# Altium schematic sheet Microcontroller.SchDoc: =SheetTitle
size B; SheetTitle: Microcontroller; DrawnBy: Samyar Sadat Akhavi; SheetNumber: 6; SheetTotal: 19
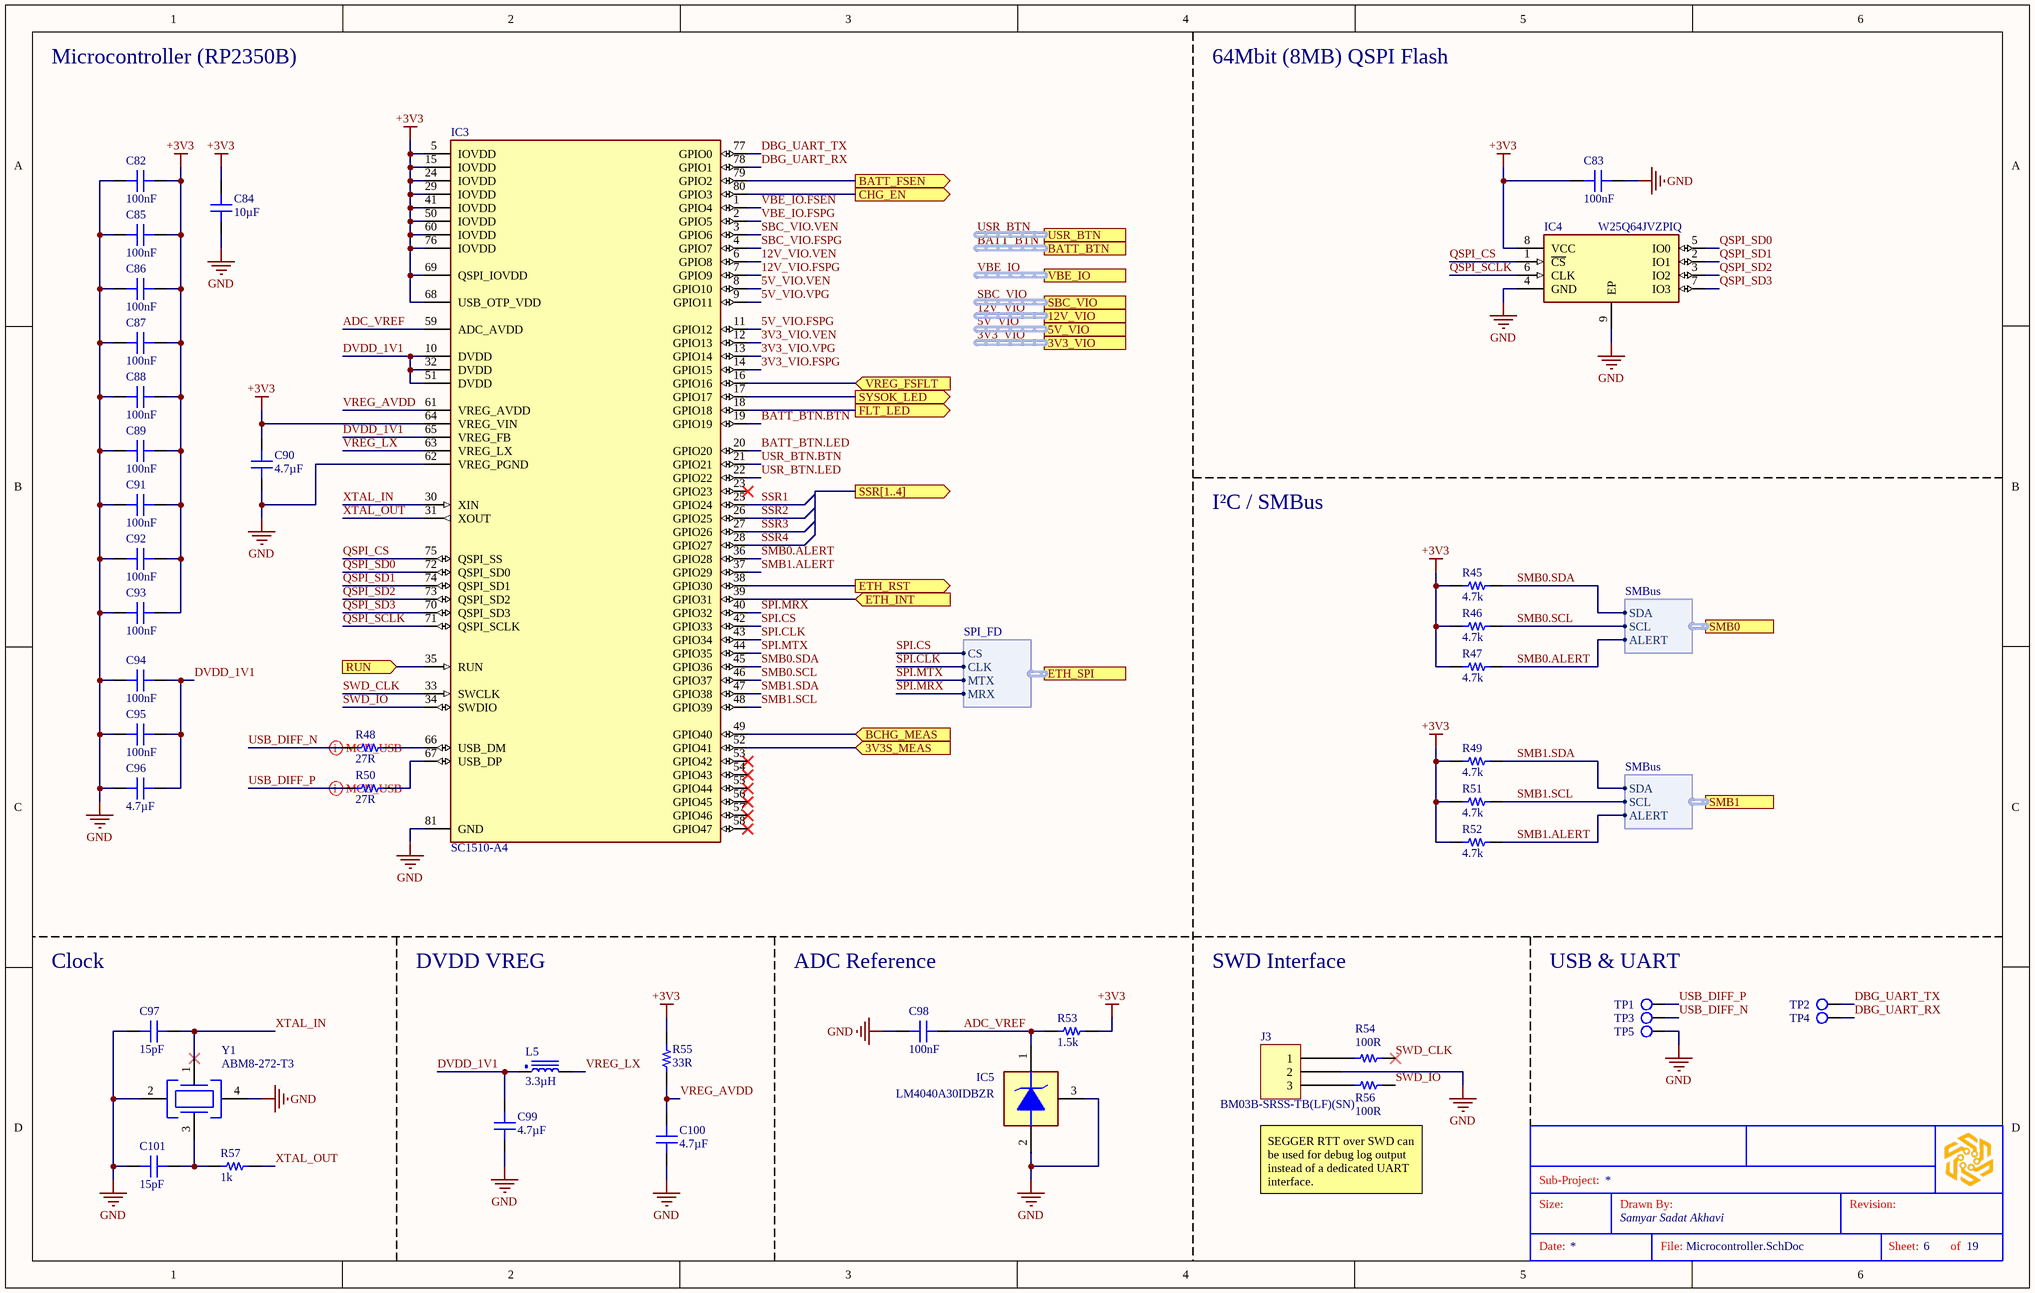
[diagram p0: Microcontroller.SchDoc]

## Parts
?  (no value)  (graphical)
C82  100nF  [CAP 0402_1005]
C83  100nF  [CAP 0603_1608]
C84  10µF  [CAP 1206_3216]
C85  100nF  [CAP 0402_1005]
C86  100nF  [CAP 0402_1005]
C87  100nF  [CAP 0402_1005]
C88  100nF  [CAP 0402_1005]
C89  100nF  [CAP 0402_1005]
C90  4.7µF  [CAP 0402_1005]
C91  100nF  [CAP 0402_1005]
C92  100nF  [CAP 0402_1005]
C93  100nF  [CAP 0402_1005]
C94  100nF  [CAP 0402_1005]
C95  100nF  [CAP 0402_1005]
C96  4.7µF  [CAP 0402_1005]
C97  15pF  [CAP 0402_1005]
C98  100nF  [CAP 0603_1608]
C99  4.7µF  [CAP 0402_1005]
C100  4.7µF  [CAP 0402_1005]
C101  15pF  [CAP 0402_1005]
IC3  SC1510-A4  [QFN40P1000X1000X90-81N-D]
IC4  W25Q64JVZPIQ  [SON127P600X500X80-9N-D]
IC5  LM4040A30IDBZR  [SOT95P237X112-3N]
J3  BM03B-SRSS-TB(LF)(SN)  [JST BM03B-SRSS-TB]
L5  3.3µH  [AOTAB201610S3R3101T]
R45  4.7k  [RES 0603_1608]
R46  4.7k  [RES 0603_1608]
R47  4.7k  [RES 0603_1608]
R48  27R  [RES 0603_1608]
R49  4.7k  [RES 0603_1608]
R50  27R  [RES 0603_1608]
R51  4.7k  [RES 0603_1608]
R52  4.7k  [RES 0603_1608]
R53  1.5k  [RES 0603_1608]
R54  100R  [RES 0603_1608]
R55  33R  [RES 0402_1005]
R56  100R  [RES 0603_1608]
R57  1k  [RES 0402_1005]
TP1  Test Point  [Test_Point_2mm]  (value not drawn)  (no BOM)
TP2  Test Point  [Test_Point_2mm]  (value not drawn)  (no BOM)
TP3  Test Point  [Test_Point_2mm]  (value not drawn)  (no BOM)
TP4  Test Point  [Test_Point_2mm]  (value not drawn)  (no BOM)
TP5  Test Point  [Test_Point_2mm]  (value not drawn)  (no BOM)
Y1  ABM8-272-T3  [ABM8272T3]

## Ports
3V3_VIO (harness V3I_VIO, see Power_Board[3B], Voltage_Regulators[5D]), 3V3S_MEAS (in, see Power_Board[2A], Power_Reset[4C]), 5V_VIO (harness V3I_VIO, see Power_Board[3B], Voltage_Regulators[5C]), 12V_VIO (harness VHP_VIO, see Power_Board[3B], Voltage_Regulators[5B]), BATT_BTN (harness USR_BTN, see Power_Board[2B], User_Control_IO[4A]), BATT_FSEN (out, see Power_Board[2B]), BCHG_MEAS (in, see Power_Board[2B], Charger_Input[2B]), CHG_EN (out, see Power_Board[2B], Charger_Input[1B]), ETH_INT (in, see Power_Board[3B]), ETH_RST (out, see Power_Board[3B]), ETH_SPI (harness SPI_FD, see Power_Board[3B]), FLT_LED (out, see Power_Board[3C]), RUN (in, see Power_Board[2A]), SBC_VIO (harness VHP_VIO, see Power_Board[3B], Voltage_Regulators[5A]), SMB0 (harness SMBus, see Power_Board[2C]), SMB1 (harness SMBus, see Power_Board[2C]), SSR[1..4] (out, see Power_Board[3B], External_SSR[2A]), SYSOK_LED (out, see Power_Board[3C]), USR_BTN (harness USR_BTN, see Power_Board[2B], User_Control_IO[4C]), VBE_IO (harness VBP_IO, see Power_Board[3A], VBAT_Output[1B]), VREG_FSFLT (in, see Power_Board[3B])

## Harnesses
SMBus: SDA, SCL, ALERT
SPI_FD: MRX, MTX, CLK, CS

## Nets
+3V3: C82.2 C83.1 C84.2 C85.2 C86.2 C87.2 C88.2 C89.2 C90.2 C91.2 C92.2 C93.2 IC3.5(IOVDD) IC3.15(IOVDD) IC3.24(IOVDD) IC3.29(IOVDD) IC3.41(IOVDD) IC3.50(IOVDD) IC3.60(IOVDD) IC3.64(VREG_VIN) IC3.68(USB_OTP_VDD) IC3.69(QSPI_IOVDD) IC3.76(IOVDD) IC4.8(VCC) R45.1 R46.1 R47.1 R49.1 R51.1 R52.1 R53.2 R55.2
GND: C82.1 C83.2 C84.1 C85.1 C86.1 C87.1 C88.1 C89.1 C90.1 C91.1 C92.1 C93.1 C94.1 C95.1 C96.1 C97.1 C98.1 C99.1 C100.1 C101.1 IC3.62(VREG_PGND) IC3.81(GND) IC4.4(GND) IC4.9(EP) IC5.2(A) IC5.3 J3.2 TP5.1 Y1.2(GND_1) Y1.4(GND_2)
3V3_VIO.FSPG: IC3.14(GPIO15)
3V3_VIO.VEN: IC3.12(GPIO13)
3V3_VIO.VPG: IC3.13(GPIO14)
3V3S_MEAS: IC3.52(GPIO41) ; port 3V3S_MEAS
5V_VIO.FSPG: IC3.11(GPIO12)
5V_VIO.VEN: IC3.8(GPIO10)
5V_VIO.VPG: IC3.9(GPIO11)
12V_VIO.FSPG: IC3.7(GPIO9)
12V_VIO.VEN: IC3.6(GPIO8)
ADC_VREF: C98.2 IC3.59(ADC_AVDD) IC5.1(K) R53.1
BATT_BTN.BTN: IC3.19(GPIO19)
BATT_BTN.LED: IC3.20(GPIO20)
BATT_FSEN: IC3.79(GPIO2) ; port BATT_FSEN
BCHG_MEAS: IC3.49(GPIO40) ; port BCHG_MEAS
CHG_EN: IC3.80(GPIO3) ; port CHG_EN
DBG_UART_RX: IC3.78(GPIO1) TP4.1
DBG_UART_TX: IC3.77(GPIO0) TP2.1
DVDD_1V1: C94.2 C95.2 C96.2 C99.2 IC3.10(DVDD) IC3.32(DVDD) IC3.51(DVDD) IC3.65(VREG_FB) L5.1
ETH_INT: IC3.39(GPIO31) ; port ETH_INT
ETH_RST: IC3.38(GPIO30) ; port ETH_RST
FLT_LED: IC3.18(GPIO18) ; port FLT_LED
QSPI_CS: IC3.75(QSPI_SS) IC4.1(~{CS})
QSPI_SCLK: IC3.71(QSPI_SCLK) IC4.6(CLK)
QSPI_SD0: IC3.72(QSPI_SD0) IC4.5(IO0)
QSPI_SD1: IC3.74(QSPI_SD1) IC4.2(IO1)
QSPI_SD2: IC3.73(QSPI_SD2) IC4.3(IO2)
QSPI_SD3: IC3.70(QSPI_SD3) IC4.7(IO3)
RUN: IC3.35(RUN) ; port RUN
SBC_VIO.FSPG: IC3.4(GPIO7)
SBC_VIO.VEN: IC3.3(GPIO6)
SMB0.ALERT: IC3.36(GPIO28) R47.2 ; port SMB0.ALERT
SMB0.SCL: IC3.46(GPIO37) R46.2 ; port SMB0.SCL
SMB0.SDA: IC3.45(GPIO36) R45.2 ; port SMB0.SDA
SMB1.ALERT: IC3.37(GPIO29) R52.2 ; port SMB1.ALERT
SMB1.SCL: IC3.48(GPIO39) R51.2 ; port SMB1.SCL
SMB1.SDA: IC3.47(GPIO38) R49.2 ; port SMB1.SDA
SPI.CLK: IC3.43(GPIO34) ; port ETH_SPI.CLK
SPI.CS: IC3.42(GPIO33) ; port ETH_SPI.CS
SPI.MRX: IC3.40(GPIO32) ; port ETH_SPI.MRX
SPI.MTX: IC3.44(GPIO35) ; port ETH_SPI.MTX
SSR1: IC3.25(GPIO24)
SSR2: IC3.26(GPIO25)
SSR3: IC3.27(GPIO26)
SSR4: IC3.28(GPIO27)
SWD_CLK: IC3.33(SWCLK) R54.1
SWD_IO: IC3.34(SWDIO) R56.1
SYSOK_LED: IC3.17(GPIO17) ; port SYSOK_LED
USB_DIFF_N: R48.1 TP3.1
USB_DIFF_P: R50.1 TP1.1
USR_BTN.BTN: IC3.21(GPIO21)
USR_BTN.LED: IC3.22(GPIO22)
VBE_IO.FSEN: IC3.1(GPIO4)
VBE_IO.FSPG: IC3.2(GPIO5)
VREG_AVDD: C100.2 IC3.61(VREG_AVDD) R55.1
VREG_FSFLT: IC3.16(GPIO16) ; port VREG_FSFLT
VREG_LX: IC3.63(VREG_LX) L5.2
XTAL_IN: C97.2 IC3.30(XIN) Y1.1(CRYSTAL_1)
XTAL_OUT: IC3.31(XOUT) R57.2
NetC101_2: C101.2 R57.1 Y1.3(CRYSTAL_2)
NetIC3_66: IC3.66(USB_DM) R48.2
NetIC3_67: IC3.67(USB_DP) R50.2
NetJ3_1: J3.1 R54.2
NetJ3_3: J3.3 R56.2

Not connected (* = marked no-connect by the designer): IC3 23(GPIO23)* 53(GPIO42)* 54(GPIO43)* 55(GPIO44)* 56(GPIO45)* 57(GPIO46)* 58(GPIO47)*

## Buses and harness runs
harness 3V3_VIO = port 3V3_VIO
harness 5V_VIO = port 5V_VIO
harness 12V_VIO = port 12V_VIO
harness BATT_BTN = port BATT_BTN
harness SBC_VIO = port SBC_VIO
harness USR_BTN = port USR_BTN
harness VBE_IO = port VBE_IO

## Layout directives
differential pair: USB_DIFF_N, USB_DIFF_P

## Notes on the sheet
- Microcontroller (RP2350B)
- 64Mbit (8MB) QSPI Flash
- I²C / SMBus
- Clock
- DVDD VREG
- ADC Reference
- SWD Interface
- USB & UART
- SEGGER RTT over SWD can be used for debug log output instead of a dedicated UART interface.
- Sub-Project:
- Size:
- Drawn By:
- Revision:
- Date:
- File:
- Sheet:
- of

## Library data of the parts
? = SGR-STDTBSB: STANDARD SCHEMATICS TITLE BLOCK
C82 C85-C89 C91-C95 = GEN-CC100NT106V3KX7R402: GENERIC 0402 MLC CAPACITOR; Tolerance: ±10%; Voltage: 6.3V; Dielectric: X7R; Part Number: GEN-CC100NT106V3KX7R402; Value: 100nF
C83 C98 = GEN-CC100NT10V50KX7R603: GENERIC 0603 MLC CAPACITOR; Tolerance: ±10%; Voltage: 50V; Dielectric: X7R; Part Number: GEN-CC100NT10V50KX7R603; Value: 100nF
C84 = GEN-CC10UT10V25KX7R1206: GENERIC 1206 MLC CAPACITOR; Tolerance: ±10%; Voltage: 25V; Dielectric: X7R; Part Number: GEN-CC10UT10V25KX7R1206; Value: 10µF
C90 C96 C99 C100 = GEN-CC4U7T106V3KX5R402: GENERIC 0402 MLC CAPACITOR; Tolerance: ±10%; Voltage: 6.3V; Dielectric: X5R; Part Number: GEN-CC4U7T106V3KX5R402; Value: 4.7µF
C97 C101 = GEN-CC15PT1V25KC0G402: GENERIC 0402 MLC CAPACITOR; Tolerance: ±1%; Voltage: 25V; Dielectric: C0G; Part Number: GEN-CC15PT1V25KC0G402; Value: 15pF
IC3 = SC1510-A4: RASPBERRY PI RP2350B A4 MICROCONTROLLER; Part Number: SC1510-A4; Manufacturer: Raspberry Pi; Supplier 1: DigiKey; Supplier Part Number 1: 2648-SC1510-A4CT-ND
IC4 = W25Q64JVZPIQ: IC FLASH 64MBIT SPI/QUAD 8WSON; Manufacturer: Winbond Electronics; Part Number: W25Q64JVZPIQ; Supplier 1: DigiKey; Supplier Part Number 1: 256-W25Q64JVZPIQ-TRAY-ND
IC5 = LM4040A30IDBZR: IC VREF SHUNT 0.1% SOT23-3; Manufacturer: Texas Instruments; Part Number: LM4040A30IDBZR; Supplier 1: DigiKey; Supplier Part Number 1: 296-20861-1-ND
J3 = BM03B-SRSS-TB(LF)(SN): CONN HEADER SMD 3POS 1MM; Manufacturer: JST Sales America Inc.; Current Rating (Amps): 0.7A; Material Flammability Rating: UL94 V-0; Number of Positions: 3; Number of Positions Loaded: All; Pitch - Mating: 0.039" (1.00mm); Shrouding: Shrouded - 4 Wall; Style: Board to Cable/Wire; Voltage Rating: 50V; Part Number: BM03B-SRSS-TB(LF)(SN); ComponentLink1Description: Datasheet; ComponentLink1URL: http://www.jst-mfg.com/product/pdf/eng/eSR.pdf; ComponentLink2Description: DigiKey Link; ComponentLink2URL: http://digikey.com/product-detail/en/jst-sales-america-inc/BM03B-SRSS-TB-LF-SN/455-1789-1-ND/926860; Connector Type: Header; Contact Finish - Mating: Tin; Contact Finish - Post: Tin; Contact Material: Copper Alloy; Contact Shape: Square; Contact Type: Male Pin; Fastening Type: Push-Pull; Features: Solder Retention; Insulation Color: Natural; Insulation Height: 0.167" (4.25mm); Insulation Material: Polyamide (PA), Nylon; LastUpdated: 1/12/2020 10:12:14 PM; Lifecycle Status: Active; Minimum Order: 1; Mounting Type: Surface Mount; Number of Rows: 1; Operating Temperature: -25°C ~ 85°C; Packaging: TapeAndReel; PartId: 14; Part Status: Active; Price: 0.24; Series: SR; Supplier 1: DigiKey; Supplier Part Number 1: 455-1789-1-ND; Termination: Solder
L5 = AOTA-B201610S3R3-101-T: FIXED IND 3.3UH 2.1A 140 MOHM; Manufacturer: Abracon LLC; Tolerance: ±20%; Saturation Current: 2.4A; Part Number: AOTA-B201610S3R3-101-T; Value: 3.3µH; Current Rating: 2.1A; DC Resistance: 140mOhm; Supplier 1: DigiKey; Supplier Part Number 1: 535-AOTA-B201610S3R3-101-TCT-ND
R45-R47 R49 R51 R52 = GEN-CRR4K7T5P8603: GENERIC 0603 CHIP RESISTOR; Tolerance: ±5%; Power: 0.125W; Part Number: GEN-CRR4K7T5P8603; Value: 4.7k
R48 R50 = GEN-CRR27T1P8603: GENERIC 0603 CHIP RESISTOR; Tolerance: ±1%; Power: 0.125W; Part Number: GEN-CRR27T1P8603; Value: 27R
R53 = GEN-CRR1K5T1P8603: GENERIC 0603 CHIP RESISTOR; Tolerance: ±1%; Power: 0.125W; Part Number: GEN-CRR1K5T1P8603; Value: 1.5k
R54 R56 = GEN-CRR100T1P8603: GENERIC 0603 CHIP RESISTOR; Tolerance: ±1%; Power: 0.125W; Part Number: GEN-CRR100T1P8603; Value: 100R
R55 = GEN-CRR33T5P16402: GENERIC 0402 CHIP RESISTOR; Tolerance: ±5%; Power: 0.0625W; Part Number: GEN-CRR33T5P16402; Value: 33R
R57 = GEN-CRR1KT1P16402: GENERIC 0402 CHIP RESISTOR; Tolerance: ±1%; Power: 0.0625W; Part Number: GEN-CRR1KT1P16402; Value: 1k
TP1-TP5 = GEN-PCBTPS2: CIRCULAR PCB TEST POINT PAD; Part Number: GEN-PCBTPS2; Size Variant: 2mm
Y1 = ABM8-272-T3: CRYSTAL 12.0000MHZ 10PF SMD; Manufacturer: Abracon LLC; Frequency: 12MHz; Stability: ±30ppm; ESR: 50Ohms; Part Number: ABM8-272-T3; Tolerance: ±30ppm; Load Capacitance: 10pF; Supplier 1: DigiKey; Supplier Part Number 1: 535-ABM8-272-T3CT-ND